# EAGLE schematic Schaltkasten (EAGLE 7.6.0)
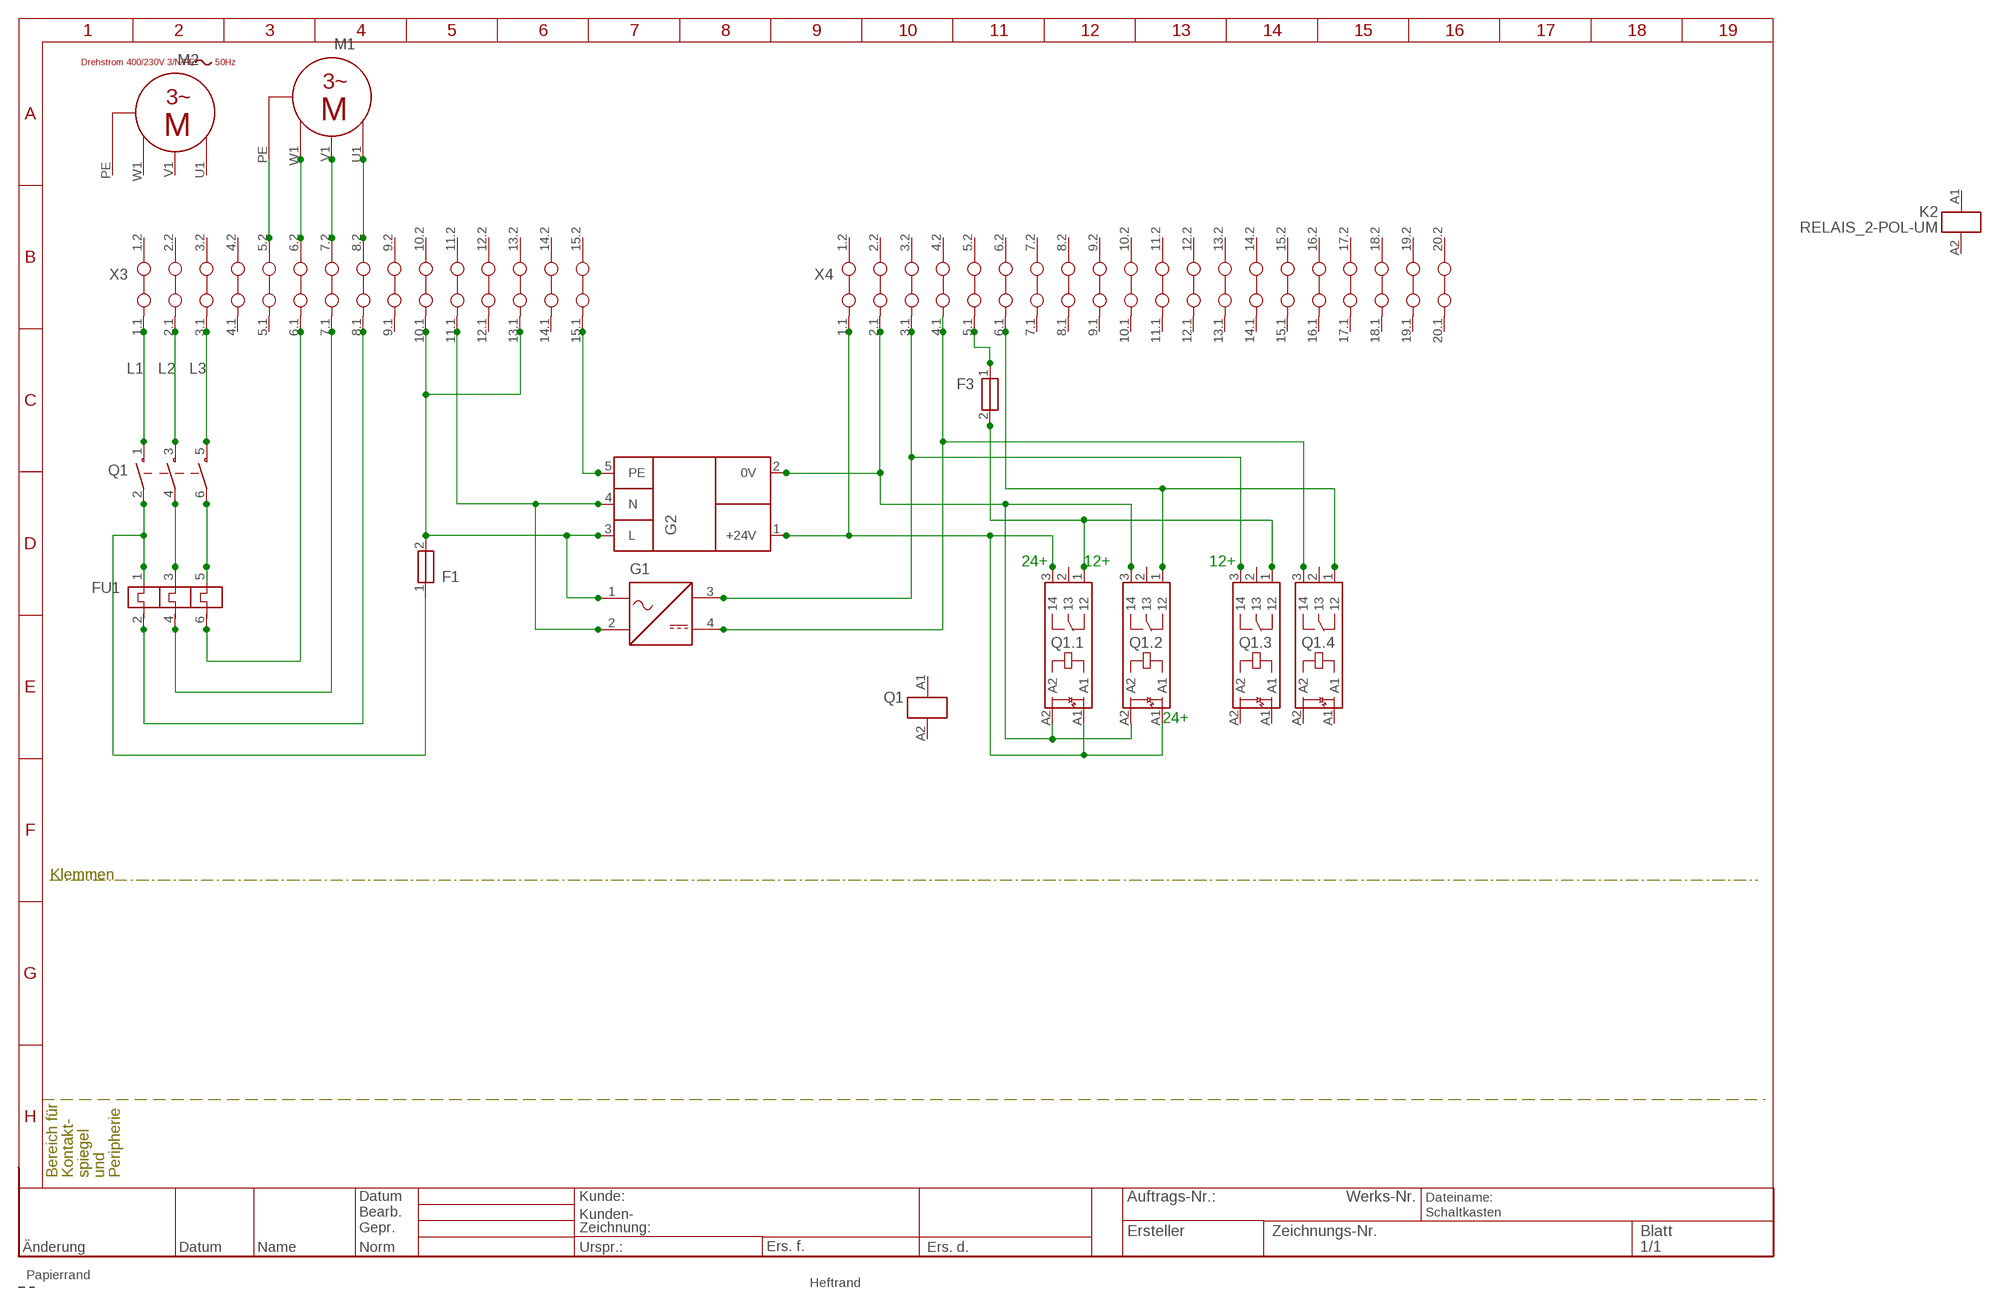
[diagram p0: schematic, sheet 1]

## Parts
F1  SICHERUNG_1-POL  [SICHERUNG_1-POL]
F3  SICHERUNG_1-POL  [SICHERUNG_1-POL]
FU1  MOTORSCHUTZSCHALTER_3-POL_THERM_AUSLOESUNG_ALTERNATIV  [MOTORSCHUTZSCHALTER_3-POL_THERM_AUSLOESUNG_ALTERNATIV]
G1  NETZTEIL_GLEICHSPANNUNG  [NETZTEIL_GLEICHSPANNUNG]
G2  NETZTEIL_MURR_24V  [NETZTEIL_MURR_24V]
K2  RELAIS_2-POL-UM  [RELAIS_2-POL-UM]
M1  MOTOR_3-POL_PE  [MOTOR_3-POL_PE]
M2  MOTOR_3-POL_PE  [MOTOR_3-POL_PE]
Q1  HAUPTSCHUETZ_3-POL  [HAUPTSCHUETZ_3-POL]
Q1.1  RELAISKLEMME_MIT_LED  [RELAISKLEMME_MIT_LED]
Q1.2  RELAISKLEMME_MIT_LED  [RELAISKLEMME_MIT_LED]
Q1.3  RELAISKLEMME_MIT_LED  [RELAISKLEMME_MIT_LED]
Q1.4  RELAISKLEMME_MIT_LED  [RELAISKLEMME_MIT_LED]
X3  KLEMME_2-15  [KLEMME_2-15]
X4  KLEMME_2-20  [KLEMME_2-20]

## Nets
L1: Q1.1 X3.1.1
L2: Q1.3 X3.2.1
L3: Q1.5 X3.3.1
N$1: G2.2(0V) Q1.1.A2 Q1.2.3 Q1.2.A2 X4.2.1
N$4: F1.1 FU1.1 Q1.2
N$5: FU1.3 Q1.4
N$6: FU1.5 Q1.6
N$7: FU1.6 X3.6.1
N$8: FU1.4 X3.7.1
N$9: FU1.2 X3.8.1
N$10: M1.U1 X3.8.2
N$11: M1.V1 X3.7.2
N$12: M1.W1 X3.6.2
N$13: F1.2 G1.1 G2.3(L) X3.10.1 X3.13.1
N$14: G2.5(PE) X3.15.1
N$15: G1.2 G2.4(N) X3.11.1
N$16: G2.1(+24V) Q1.1.3 Q1.1.A1 Q1.2.A1 X4.1.1
N$18: G1.3 Q1.3.3 X4.3.1
N$19: G1.4 Q1.4.3 X4.4.1
N$20: F3.1 X4.5.1
N$21: Q1.2.1 Q1.4.1 X4.6.1
N$22: F3.2 Q1.1.1 Q1.3.1
N$23: M1.PE X3.5.2
Unconnected: K2.11 K2.12 K2.14 K2.21 K2.22 K2.24 K2.A1 K2.A2 M2.PE M2.U1 M2.V1 M2.W1 Q1.1.2 Q1.2.2 Q1.3.2 Q1.3.A1 Q1.3.A2 Q1.4.2 Q1.4.A1 Q1.4.A2 Q1.A1 Q1.A2 X3.1.2 X3.2.2 X3.3.2 X3.4.1 X3.4.2 X3.5.1 X3.9.1 X3.9.2 X3.10.2 X3.11.2 X3.12.1 X3.12.2 X3.13.2 X3.14.1 X3.14.2 X3.15.2 X4.1.2 X4.2.2 X4.3.2 X4.4.2 X4.5.2 X4.6.2 X4.7.1 X4.7.2 X4.8.1 X4.8.2 X4.9.1 X4.9.2 X4.10.1 X4.10.2 X4.11.1 X4.11.2 X4.12.1 X4.12.2 X4.13.1 X4.13.2 X4.14.1 X4.14.2 X4.15.1 X4.15.2 X4.16.1 X4.16.2 X4.17.1 X4.17.2 X4.18.1 X4.18.2 X4.19.1 X4.19.2 X4.20.1 X4.20.2

## Notes on the sheet
- 24+ | 12+ | 12+
- 24+

## Library data of the parts
F1 F3 = e-sicherungen:SICHERUNG_1-POL: Sicherung, 1-pol.
FU1 = e-motorschutzschalter:MOTORSCHUTZSCHALTER_3-POL_THERM_AUSLOESUNG_ALTERNATIV: Motorschutzschalter 3-pol. mit thermischer Auslösung, allgemein (alternativ)
G1 = e-stromversorgungselemente:NETZTEIL_GLEICHSPANNUNG: Netzteil, Gleichspannung
G2 = e-stromversorgungselemente:NETZTEIL_MURR_24V: Netzteil, Murr, 24 Volt
K2 = e-schuetze-relais:RELAIS_2-POL-UM: Relais mit 2 Wechsleschalter
M1 M2 = e-motoren:MOTOR_3-POL_PE: 3-Phasen-Motor mit PE
Q1 = e-schuetze-relais:HAUPTSCHUETZ_3-POL: Hauptschütz mit 3 Schließern
Q1.1-Q1.4 = e-klemmen:RELAISKLEMME_MIT_LED: Klemme mit Relais (Wechselkontakt) und LED
X3 = e-klemmen:KLEMME_2-15: Klemme 2 15
X4 = e-klemmen:KLEMME_2-20: Klemme 2 20